# Altium schematic sheet Source.SchDoc
size A4
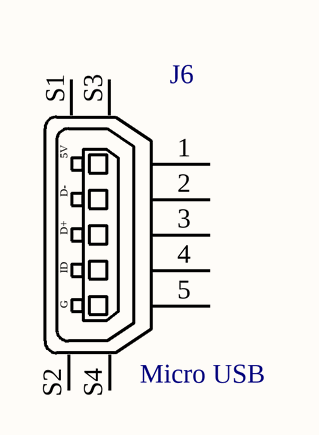
[diagram p0: Source.SchDoc]

## Parts
J6  Micro USB  [HRS_ZX62D-B-5P8_ZX62D-B-5P8(Primary)]

## Nets

Not connected (* = marked no-connect by the designer): J6 1 2 3 4 5 S1(SHIELD) S2(SHIELD) S3(SHIELD) S4(SHIELD)

## Notes on the sheet
- (in symbol ZX62D-B-5P8) G         ID         D+        D-         5V

## Library data of the parts
J6 = ZX62D-B-5P8: SMD+DIP Micro USB; MICRO-B-SMD; MF: Hirose; Package: None; Price: None; Availability: Unavailable; MP: ZX62D-B-5P8; SnapEDA_Link: https://www.snapeda.com/parts/ZX62D-B-5P8/Hirose%20Electric%20Co%20Ltd/view-part/?ref=snap; Value: *